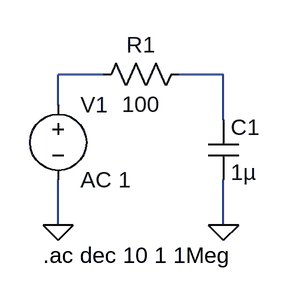
[diagram p0: schematic RC.asc]
RC.asc, the LTspice schematic file:
Version 4.1
SHEET 1 880 680
WIRE 176 80 128 80
WIRE 304 80 256 80
WIRE 128 112 128 80
WIRE 304 128 304 80
WIRE 128 240 128 192
WIRE 304 240 304 192
FLAG 128 240 0
FLAG 304 240 0
SYMBOL cap 288 128 R0
SYMATTR InstName C1
SYMATTR Value 1µ
SYMBOL res 272 64 R90
WINDOW 0 0 56 VBottom 2
WINDOW 3 32 56 VTop 2
SYMATTR InstName R1
SYMATTR Value 100
SYMBOL voltage 128 96 R0
WINDOW 123 0 0 Left 0
WINDOW 39 0 0 Left 0
SYMATTR InstName V1
SYMATTR Value AC 1
TEXT 112 272 Left 2 !.ac dec 10 1 1Meg

The netlist it stands for:
* RC.asc
C1 N002 0 1µ
R1 N002 N001 100
V1 N001 0 AC 1
.ac dec 10 1 1Meg
.backanno
.end